# Altium schematic sheet ak8975_spi.SchDoc
size A4
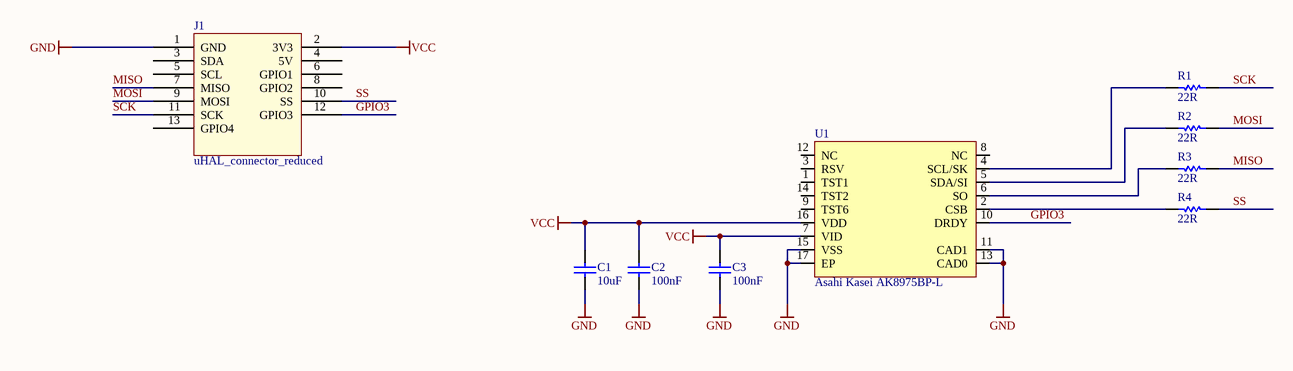
[diagram p0: ak8975_spi.SchDoc]

## Parts
C1  Capacitance: 10uF  [CAPC1608X90X35ML10T15]  (hidden comment: Murata GCM188R71H104KA57D)
C2  Capacitance: 100nF  [CAPC1608X90X35ML10T15]  (hidden comment: Murata GCM188R71H104KA57D)
C3  Capacitance: 100nF  [CAPC1608X90X35ML10T15]  (hidden comment: Murata GCM188R71H104KA57D)
J1  uHAL_connector_reduced  [PCB-45ncoppm4oopozvqifsq-1]
R1  22R  [RESC1608X05N]
R2  22R  [RESC1608X05N]
R3  22R  [RESC1608X05N]
R4  22R  [RESC1608X05N]
U1  Asahi Kasei AK8975BP-L  [PCB-e1nx98ugchmxbk2nqwbe-1]

## Nets
GND: C1.2 C2.2 C3.2 J1.1(GND) U1.11(CAD1) U1.13(CAD0) U1.15(VSS) U1.17(EP)
VCC: C1.1 C2.1 C3.1 J1.2(3V3) U1.7(VID) U1.16(VDD)
GPIO3: J1.12(GPIO3) U1.10(DRDY)
MISO: J1.7(MISO) R3.1
MOSI: J1.9(MOSI) R2.1
SCK: J1.11(SCK) R1.1
SS: J1.10(SS) R4.1
NetR1_2: R1.2 U1.4(SCL/SK)
NetR2_2: R2.2 U1.5(SDA/SI)
NetR3_2: R3.2 U1.6(SO)
NetR4_2: R4.2 U1.2(CSB)

Not connected (* = marked no-connect by the designer): J1 3(SDA) 4(5V) 5(SCL) 6(GPIO1) 8(GPIO2) 13(GPIO4); U1 1(TST1) 3(RSV) 8(NC) 9(TST6) 12(NC) 14(TST2)

## Library data of the parts
C1-C3 = CMP-119667-3: CAP CER 0.1UF 50V 10% X7R 0603; Lead-Free Status: Lead Free; Voltage Rating (DC): 50.0 V; Capacitance Tolerance: ±10%; Dielectric Characteristic: X7R; Octopart Url: https://octopart.com/gcm188r71h104ka57d-murata-7894792; OctopartID: 3480fdf266eeeb47; Packaging: Cut Tape (CT); REACH SVHC Compliance: No SVHC; RoHS: Compliant
J1 = CMP-2q23h2cwhjlfm8s6r7i8-1: connector for uHAL with reduced pin number; CustomComponentID: 2q23h2cwhjlfm8s6r7i8
R1-R4 = CMP-31acf99032f6ee6b-1: RCA Series 0603 0.1 W 0 O Jumper Surface Mount Thick Film Chip Resistor; Manufacturer Part Number: RCA06030000ZSEA; Lead-Free Status: Lead Free; Power Rating: 100 mW; Case/Package (SI): 1608; RoHS: Compliant; Case/Package: 0603, 1608; OctopartID: 31acf99032f6ee6b; Packaging: Cut Tape (CT); Octopart URL: https://octopart.com/rca06030000zsea-vishay-20325948
U1 = CMP-3b1ff0b150b6e4d8-1: 3-axis Electronic Compass; Octopart URL: https://octopart.com/ak8975bp-l-asahi+kasei-44322511; Manufacturer Part Number: AK8975BP-L; OctopartID: 3b1ff0b150b6e4d8